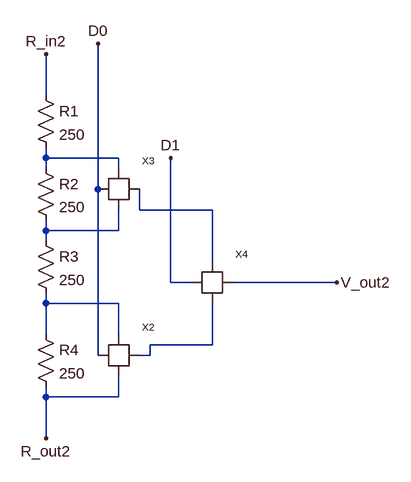
[diagram p0: schematic 2_bit_dac.asc]
2_bit_dac.asc, the LTspice schematic file:
Version 4
SHEET 1 1160 704
WIRE 256 48 256 -16
WIRE 256 144 256 128
WIRE 368 144 256 144
WIRE 256 160 256 144
WIRE 368 160 368 144
WIRE 336 192 336 -32
WIRE 400 224 400 192
WIRE 512 224 400 224
WIRE 256 256 256 240
WIRE 368 256 368 224
WIRE 368 256 256 256
WIRE 256 272 256 256
WIRE 512 304 512 224
WIRE 448 336 448 144
WIRE 480 336 448 336
WIRE 704 336 544 336
WIRE 256 368 256 352
WIRE 368 368 256 368
WIRE 256 416 256 368
WIRE 368 416 368 368
WIRE 512 432 512 368
WIRE 512 432 416 432
WIRE 336 448 336 192
WIRE 416 448 416 432
WIRE 416 448 400 448
WIRE 256 512 256 496
WIRE 368 512 368 480
WIRE 368 512 256 512
WIRE 256 576 256 512
FLAG 704 336 V_out2
FLAG 256 -16 R_in2
FLAG 256 576 R_out2
FLAG 336 -32 D0
FLAG 448 144 D1
SYMBOL res 240 32 R0
SYMATTR InstName R1
SYMATTR Value 250
SYMBOL res 240 144 R0
SYMATTR InstName R2
SYMATTR Value 250
SYMBOL res 240 256 R0
SYMATTR InstName R3
SYMATTR Value 250
SYMBOL switch 368 448 R0
SYMATTR InstName X2
SYMBOL switch 368 192 R0
SYMATTR InstName X3
SYMBOL switch 512 336 R0
SYMATTR InstName X4
SYMBOL res 240 400 R0
SYMATTR InstName R4
SYMATTR Value 250

The netlist it stands for:
* 2_bit_dac.asc
R1 R_in2 N001 250
R2 N001 N003 250
R3 N003 N004 250
XX2 D0 N004 R_out2 N005 switch  ; pins digital_input Vin_1 Vin_2 Vout
XX3 D0 N001 N003 N002 switch  ; pins digital_input Vin_1 Vin_2 Vout
XX4 D1 N002 N005 V_out2 switch  ; pins digital_input Vin_1 Vin_2 Vout
R4 N004 R_out2 250
.backanno
.end